# Altium schematic sheet 00-ps2-blueretro.SchDoc
size A; SheetNumber: 1; SheetTotal: 5
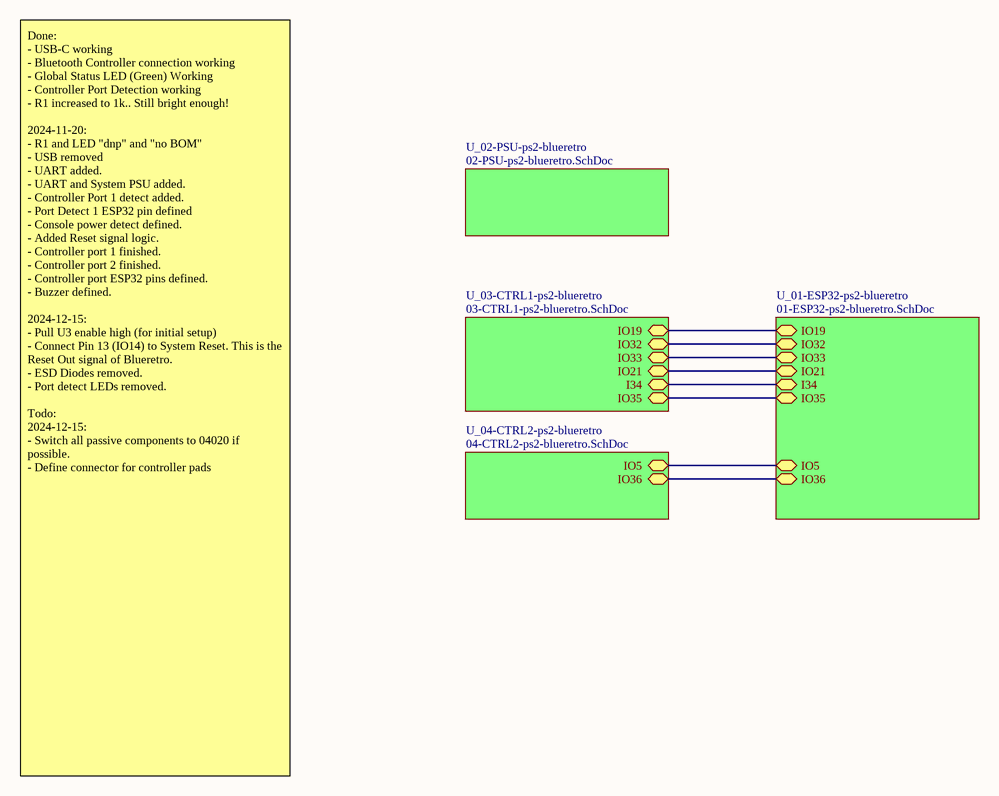
[diagram p0: 00-ps2-blueretro.SchDoc]

## Sub-sheets
U_01-ESP32-ps2-blueretro = 01-ESP32-ps2-blueretro.SchDoc: IO19 (bidir), IO32 (bidir), I34 (bidir), IO33 (bidir), IO21 (bidir), IO35 (bidir), IO5 (bidir), IO36 (bidir)
U_02-PSU-ps2-blueretro = 02-PSU-ps2-blueretro.SchDoc: no entries
U_03-CTRL1-ps2-blueretro = 03-CTRL1-ps2-blueretro.SchDoc: IO19 (bidir), IO32 (bidir), IO33 (bidir), IO21 (bidir), I34 (bidir), IO35 (bidir)
U_04-CTRL2-ps2-blueretro = 04-CTRL2-ps2-blueretro.SchDoc: IO5 (bidir), IO36 (bidir)

## Nets
(unnamed): sheet U_01-ESP32-ps2-blueretro/IO19, sheet U_03-CTRL1-ps2-blueretro/IO19
(unnamed): sheet U_01-ESP32-ps2-blueretro/IO32, sheet U_03-CTRL1-ps2-blueretro/IO32
(unnamed): sheet U_01-ESP32-ps2-blueretro/I34, sheet U_03-CTRL1-ps2-blueretro/I34
(unnamed): sheet U_01-ESP32-ps2-blueretro/IO33, sheet U_03-CTRL1-ps2-blueretro/IO33
(unnamed): sheet U_01-ESP32-ps2-blueretro/IO21, sheet U_03-CTRL1-ps2-blueretro/IO21
(unnamed): sheet U_01-ESP32-ps2-blueretro/IO35, sheet U_03-CTRL1-ps2-blueretro/IO35
(unnamed): sheet U_01-ESP32-ps2-blueretro/IO5, sheet U_04-CTRL2-ps2-blueretro/IO5
(unnamed): sheet U_01-ESP32-ps2-blueretro/IO36, sheet U_04-CTRL2-ps2-blueretro/IO36

## Notes on the sheet
- Done:
  - USB-C working
  - Bluetooth Controller connection working
  - Global Status LED (Green) Working
  - Controller Port Detection working
  - R1 increased to 1k.. Still bright enough!
  2024-11-20:
  - R1 and LED "dnp" and "no BOM"
  - USB removed
  - UART added.
  - UART and System PSU added.
  - Controller Port 1 detect added.
  - Port Detect 1 ESP32 pin defined
  - Console power detect defined.
  - Added Reset signal logic.
  - Controller port 1 finished.
  - Controller port 2 finished.
  - Controller port ESP32 pins defined.
  - Buzzer defined.
  2024-12-15:
  - Pull U3 enable high (for initial setup)
  - Connect Pin 13 (IO14) to System Reset. This is the Reset Out signal of Blueretro.
  - ESD Diodes removed.
  - Port detect LEDs removed.
  Todo:
  2024-12-15:
  - Switch all passive components to 04020 if possible.
  - Define connector for controller pads